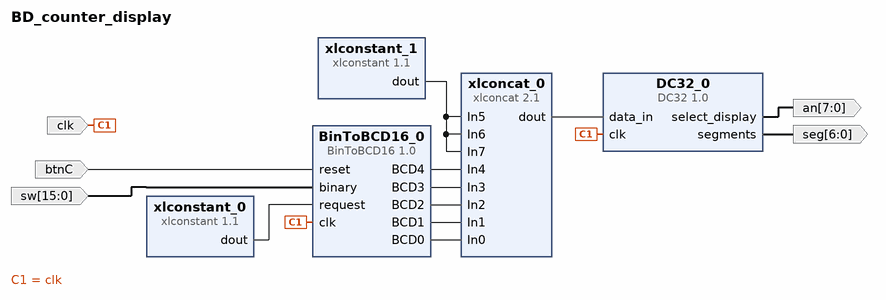
[diagram p0: block diagram of the top level]
# Vivado block design BD_counter_display, Vivado 2015.4
create_bd_design BD_counter_display

create_bd_port -dir O -from 7 -to 0 an
create_bd_port -dir O -from 6 -to 0 seg
create_bd_port -dir I clk
create_bd_port -dir I btnC
create_bd_port -dir I -from 15 -to 0 sw

create_bd_cell -type ip -vlnv ua.pt:user:DC32:1.0 DC32_0
create_bd_cell -type ip -vlnv ua.pt:user:BinToBCD16:1.0 BinToBCD16_0
create_bd_cell -type ip -vlnv xilinx.com:ip:xlconstant:1.1 xlconstant_0
create_bd_cell -type ip -vlnv xilinx.com:ip:xlconcat:2.1 xlconcat_0
set_property -dict [list \
  CONFIG.NUM_PORTS 8 \
  CONFIG.IN0_WIDTH 4 \
  CONFIG.IN1_WIDTH 4 \
  CONFIG.IN2_WIDTH 4 \
  CONFIG.IN3_WIDTH 4 \
  CONFIG.IN4_WIDTH 4 \
] [get_bd_cells xlconcat_0]
create_bd_cell -type ip -vlnv xilinx.com:ip:xlconstant:1.1 xlconstant_1
set_property -dict {CONFIG.CONST_WIDTH 4 CONFIG.CONST_VAL 0} [get_bd_cells xlconstant_1]

# ---- connections ----

connect_bd_net [get_bd_pins DC32_0/select_display] [get_bd_ports an]
connect_bd_net [get_bd_pins DC32_0/segments] [get_bd_ports seg]
connect_bd_net [get_bd_ports clk] [get_bd_pins BinToBCD16_0/clk] [get_bd_pins DC32_0/clk]
connect_bd_net [get_bd_ports btnC] [get_bd_pins BinToBCD16_0/reset]
connect_bd_net [get_bd_ports sw] [get_bd_pins BinToBCD16_0/binary]
connect_bd_net [get_bd_pins xlconstant_0/dout] [get_bd_pins BinToBCD16_0/request]
connect_bd_net [get_bd_pins xlconcat_0/dout] [get_bd_pins DC32_0/data_in]
connect_bd_net [get_bd_pins xlconstant_1/dout] [get_bd_pins xlconcat_0/In5] [get_bd_pins xlconcat_0/In6] [get_bd_pins xlconcat_0/In7]
connect_bd_net [get_bd_pins BinToBCD16_0/BCD4] [get_bd_pins xlconcat_0/In4]
connect_bd_net [get_bd_pins BinToBCD16_0/BCD3] [get_bd_pins xlconcat_0/In3]
connect_bd_net [get_bd_pins BinToBCD16_0/BCD2] [get_bd_pins xlconcat_0/In2]
connect_bd_net [get_bd_pins BinToBCD16_0/BCD1] [get_bd_pins xlconcat_0/In1]
connect_bd_net [get_bd_pins BinToBCD16_0/BCD0] [get_bd_pins xlconcat_0/In0]

validate_bd_design
save_bd_design
